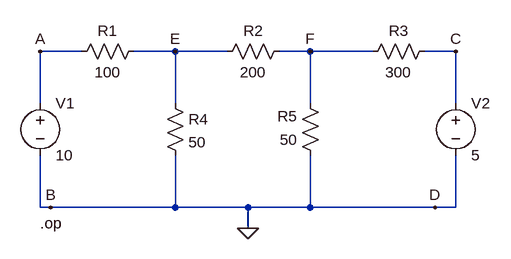
[diagram p0: schematic KVL_Verification.asc]
KVL_Verification.asc, the LTspice schematic file:
Version 4
SHEET 1 880 680
WIRE 0 -304 -64 -304
WIRE 144 -304 80 -304
WIRE 224 -304 144 -304
WIRE 352 -304 304 -304
WIRE 448 -304 352 -304
WIRE 576 -304 528 -304
WIRE -64 -224 -64 -304
WIRE 144 -224 144 -304
WIRE 352 -224 352 -304
WIRE 576 -224 576 -304
WIRE -64 -64 -64 -144
WIRE -48 -64 -64 -64
WIRE 144 -64 144 -144
WIRE 144 -64 -48 -64
WIRE 256 -64 144 -64
WIRE 352 -64 352 -144
WIRE 352 -64 256 -64
WIRE 544 -64 352 -64
WIRE 576 -64 576 -144
WIRE 576 -64 544 -64
WIRE 256 -32 256 -64
FLAG 256 -32 0
FLAG -64 -304 A
FLAG -48 -64 B
FLAG 144 -304 E
FLAG 352 -304 F
FLAG 576 -304 C
FLAG 544 -64 D
SYMBOL res -16 -288 R270
WINDOW 0 32 56 VTop 2
WINDOW 3 0 56 VBottom 2
SYMATTR InstName R1
SYMATTR Value 100
SYMBOL res 320 -320 R90
WINDOW 0 0 56 VBottom 2
WINDOW 3 32 56 VTop 2
SYMATTR InstName R2
SYMATTR Value 200
SYMBOL res 432 -288 R270
WINDOW 0 32 56 VTop 2
WINDOW 3 0 56 VBottom 2
SYMATTR InstName R3
SYMATTR Value 300
SYMBOL res 128 -240 R0
SYMATTR InstName R4
SYMATTR Value 50
SYMBOL res 368 -128 R180
WINDOW 0 36 76 Left 2
WINDOW 3 36 40 Left 2
SYMATTR InstName R5
SYMATTR Value 50
SYMBOL voltage -64 -240 R0
WINDOW 123 0 0 Left 0
WINDOW 39 0 0 Left 0
SYMATTR InstName V1
SYMATTR Value 10
SYMBOL voltage 576 -240 R0
SYMATTR InstName V2
SYMATTR Value 5
TEXT -64 -40 Left 2 !.op

The netlist it stands for:
* KVL_Verification.asc
R1 A E 100
R2 F E 200
R3 F C 300
R4 E 0 50
R5 0 F 50
V1 A 0 10
V2 C 0 5
.op
.backanno
.end

* Results of the author's LTspice run, read from the files saved beside the schematic
* Operating Point:
*   V(a) = 10 V
*   V(e) = 3.017 V
*   V(f) = 1.121 V
*   V(c) = 5 V
*   I(R5) = -22.41 mA
*   I(R4) = 60.34 mA
*   I(R3) = -12.93 mA
*   I(R2) = -9.483 mA
*   I(R1) = 69.83 mA
*   I(V2) = -12.93 mA
*   I(V1) = -69.83 mA